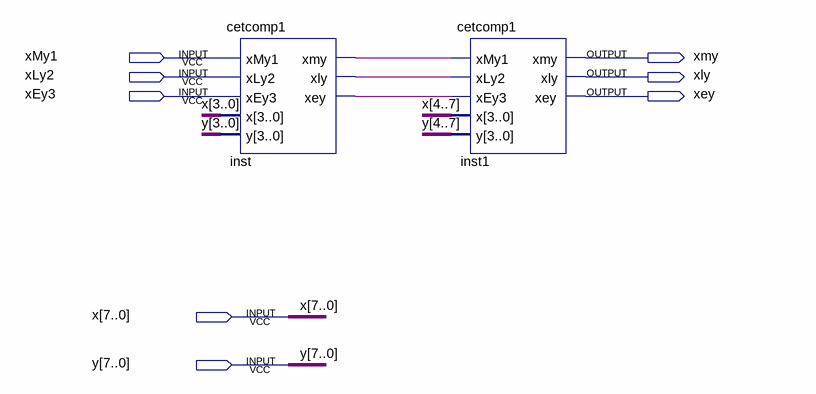
[diagram p0: schematic sheet]
// Quartus schematic voscomp1.bdf as structural Verilog: 2 symbols, 8 pins
module voscomp1 (
  input  xMy1,
  input  xLy2,
  input  xEy3,
  input  [7:0] x,
  input  [7:0] y,
  output xmy,
  output xly,
  output xey
);

  wire inst_xey, inst_xly, inst_xmy;

  cetcomp1 inst (
    .xMy1(xMy1), .xLy2(xLy2), .xEy3(xEy3), .x(x[3:0]), .y(y[3:0]), .xmy(inst_xmy), .xly(inst_xly),
    .xey(inst_xey));
  cetcomp1 inst1 (
    .xMy1(inst_xmy), .xLy2(inst_xly), .xEy3(inst_xey), .x({x[4], x[5], x[6], x[7]}),
    .y({y[4], y[5], y[6], y[7]}), .xmy(xmy), .xly(xly), .xey(xey));
endmodule
